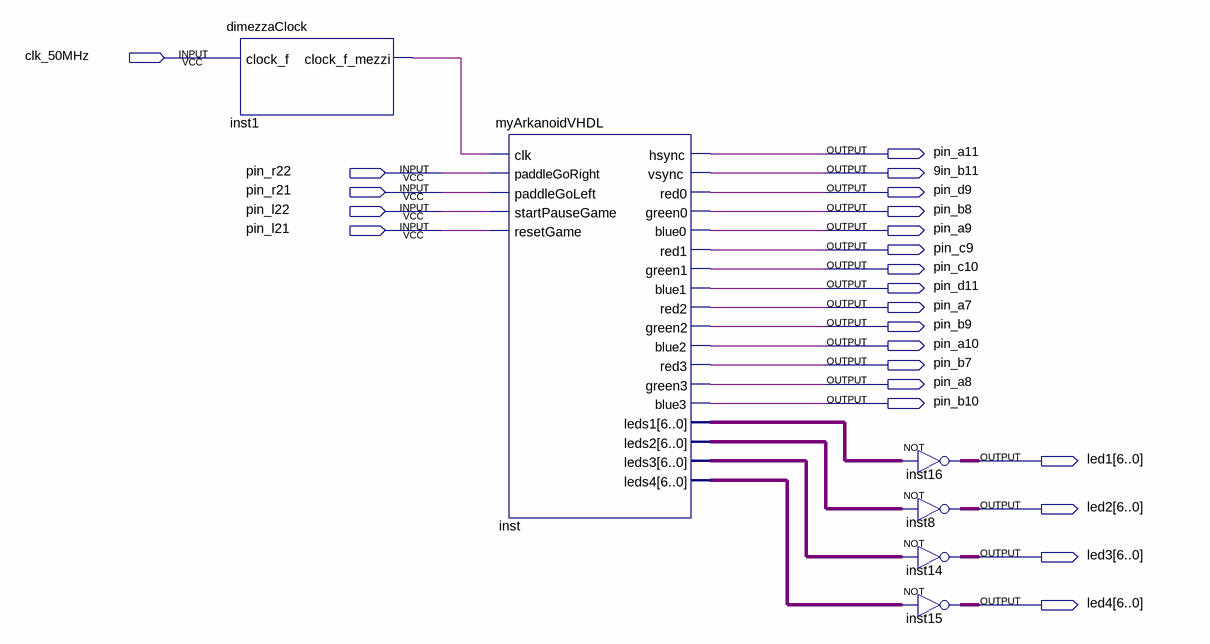
[diagram p0: schematic sheet]
// Quartus schematic myArkanoidSchematic.bdf as structural Verilog: 6 symbols, 23 pins
module myArkanoidSchematic (
  input  clk_50MHz,
  input  pin_r22,
  input  pin_r21,
  input  pin_l22,
  input  pin_l21,
  output pin_a11,
  output \9in_b11 ,
  output pin_d9,
  output pin_b8,
  output pin_a9,
  output pin_c9,
  output pin_c10,
  output pin_d11,
  output pin_a7,
  output pin_b9,
  output pin_a10,
  output pin_b7,
  output pin_a8,
  output pin_b10,
  output [6:0] led1,
  output [6:0] led2,
  output [6:0] led3,
  output [6:0] led4
);

  wire inst1_clock_f_mezzi;
  wire [6:0] inst_leds1, inst_leds2, inst_leds3, inst_leds4;

  dimezzaClock inst1 (.clock_f(clk_50MHz), .clock_f_mezzi(inst1_clock_f_mezzi));
  myArkanoidVHDL inst (
    .clk(inst1_clock_f_mezzi), .paddleGoRight(pin_r22), .paddleGoLeft(pin_r21), .startPauseGame(pin_l22),
    .resetGame(pin_l21), .hsync(pin_a11), .vsync(\9in_b11 ), .red0(pin_d9), .green0(pin_b8), .blue0(pin_a9),
    .red1(pin_c9), .green1(pin_c10), .blue1(pin_d11), .red2(pin_a7), .green2(pin_b9), .blue2(pin_a10),
    .red3(pin_b7), .green3(pin_a8), .blue3(pin_b10), .leds1(inst_leds1), .leds2(inst_leds2),
    .leds3(inst_leds3), .leds4(inst_leds4));
  assign led1 = ~inst_leds1;  // NOT inst16, 7 bits wide
  assign led2 = ~inst_leds2;  // NOT inst8, 7 bits wide
  assign led3 = ~inst_leds3;  // NOT inst14, 7 bits wide
  assign led4 = ~inst_leds4;  // NOT inst15, 7 bits wide
endmodule
